# Altium project Motor Driver.PrjPcb
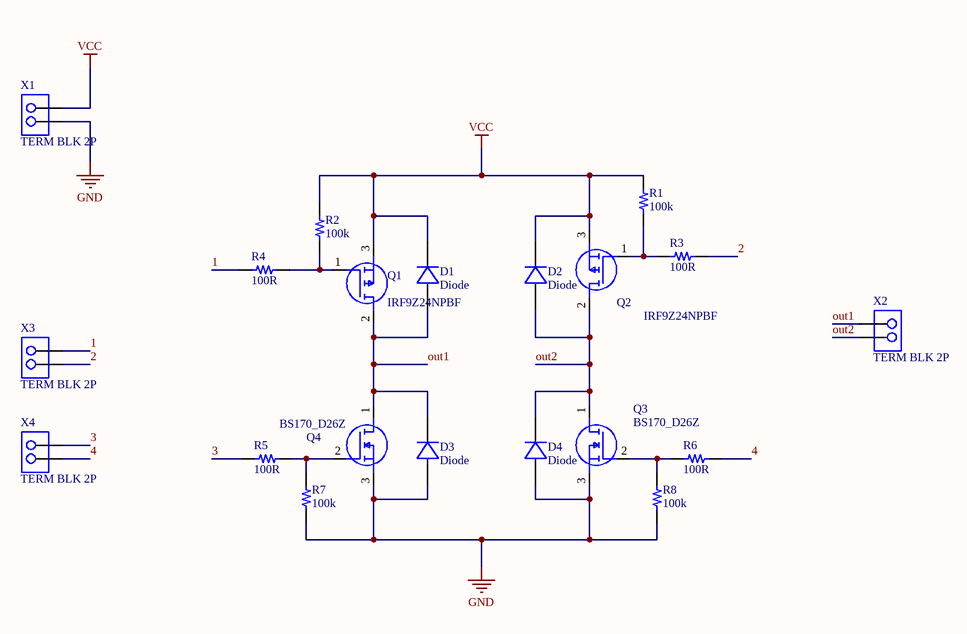
[diagram p0: Sheet1.SchDoc]
1 sheet, 20 parts. Net scope: global (net labels, ports and power ports of the same name join across sheets).
Board file: PCB1.PcbDoc

## Sheet Sheet1.SchDoc
size A; SheetNumber: 1; SheetTotal: 1

### Parts
D1  Diode  [Diode DO_41]
D2  Diode  [Diode DO_41]
D3  Diode  [Diode DO_41]
D4  Diode  [Diode DO_41]
Q1  IRF9Z24NPBF  [TO254P469X1042X1967-3P]
Q2  IRF9Z24NPBF  [TO254P469X1042X1967-3P]
Q3  BS170_D26Z  [TO-92_FAIRCHILD]
Q4  BS170_D26Z  [TO-92_FAIRCHILD]
R1  100k  [Resistor THT]
R2  100k  [Resistor THT]
R3  100R  [Resistor THT]
R4  100R  [Resistor THT]
R5  100R  [Resistor THT]
R6  100R  [Resistor THT]
R7  100k  [Resistor THT]
R8  100k  [Resistor THT]
X1  TERM BLK 2P  [TERM BLK 2P]
X2  TERM BLK 2P  [TERM BLK 2P]
X3  TERM BLK 2P  [TERM BLK 2P]
X4  TERM BLK 2P  [TERM BLK 2P]

### Nets
GND: D3.8 D4.8 Q3.3(S) Q4.3(S) R7.1 R8.1 X1.1
VCC: D1.9 D2.9 Q1.3(S) Q2.3(S) R1.2 R2.2 X1.0
1: R4.2 X3.0
2: R3.1 X3.1
3: R5.2 X4.0
4: R6.1 X4.1
out1: D1.8 D3.9 Q1.2(D) Q4.1(D) X2.1
out2: D2.8 D4.9 Q2.2(D) Q3.1(D) X2.0
NetQ1_1: Q1.1(G) R2.1 R4.1
NetQ2_1: Q2.1(G) R1.1 R3.2
NetQ3_2: Q3.2(G) R6.2 R8.2
NetQ4_2: Q4.2(G) R5.1 R7.2

### Library data of the parts
D1-D4 = Diode: Manifacturer Part  number: 1N4007; Manifacturer: onsemi; Supplier: Digi-key; Supplier Part Number: 1N4007FSTR-ND
Q1 Q2 = IRF9Z24NPBF: MOSFET (P-Channel); Manufacturer_Name: Infineon; Datasheet Link: https://www.infineon.com/dgdl/irf9z24npbf.pdf?fileId=5546d462533600a40153561218961ddb; Height: 4.69mm; Manufacturer_Part_Number: IRF9Z24NPBF; Mouser Part Number: 942-IRF9Z24NPBF; Mouser Price/Stock: https://www.mouser.co.uk/ProductDetail/Infineon-Technologies/IRF9Z24NPBF?qs=9%252BKlkBgLFf36xC9PMFW8Lg%3D%3D; Arrow Part Number: IRF9Z24NPBF; Arrow Price/Stock: https://www.arrow.com/en/products/irf9z24npbf/infineon-technologies-ag?region=europe
Q3 Q4 = BS170_D26Z: MOSFET (N-Channel); Manufacturer_Name: onsemi; Manufacturer_Part_Number: BS170_D26Z; Mouser Part Number: 512-BS170D26Z; Mouser Price/Stock: http://www.mouser.com/Search/ProductDetail.aspx?qs=38EqnX883HDzR6DEwmZa%2fA%3d%3d; Arrow Part Number: BS170_D26Z; Arrow Price/Stock: https://www.arrow.com/en/products/bs170-d26z/on-semiconductor?region=nac
R1-R8 = Resistor THT: 1 kOhms ±5% 0.25W, 1/4W Through Hole Resistor Axial Flame Retardant Coating, Safety Carbon Film; Manifacturer Part Number: CF14JT1K00; Manifacturer: Stackpole Electronics Inc; Supplier: Degi-key; Supplier Part Number: CF14JT1K00TR-ND - Tape & Reel (TR)
X1-X4 = TERM BLK 2P: TERM BLK 2P SIDE ENT 5.08MM PCB; Manufacturer: Weidmüller; Manufacturer Part Number: 1760510000; Supplier: Digi-key; Supplier Part Number: 281-1882-ND